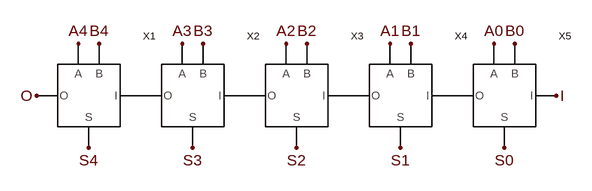
[diagram p0: schematic FULLADDER5.asc]
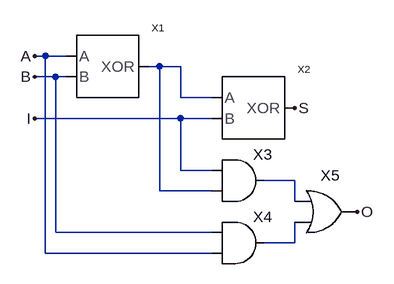
[diagram p1: sub-circuit fulladder.asc]
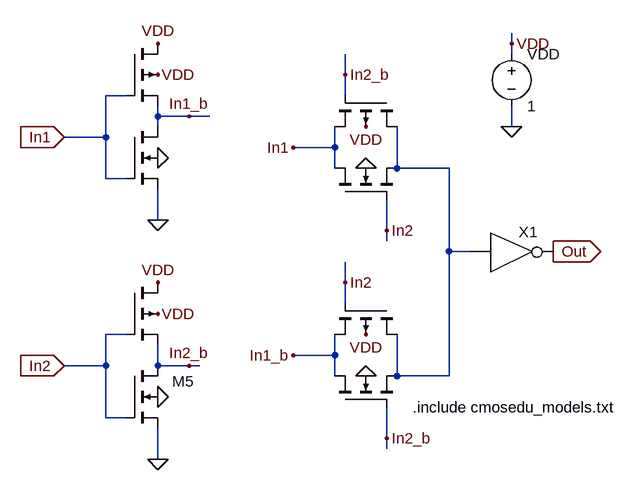
[diagram p2: sub-circuit xor.asc]
FULLADDER5.asc, the LTspice schematic file:
Version 4
SHEET 1 880 680
FLAG 0 192 O
FLAG 704 112 A0
FLAG 544 112 A1
FLAG 384 112 A2
FLAG 224 112 A3
FLAG 64 112 A4
FLAG 720 272 S0
FLAG 560 272 S1
FLAG 400 272 S2
FLAG 240 272 S3
FLAG 80 272 S4
FLAG 736 112 B0
FLAG 576 112 B1
FLAG 416 112 B2
FLAG 256 112 B3
FLAG 96 112 B4
FLAG 800 192 I
SYMBOL FULLADDER 80 192 R0
SYMATTR InstName X1
SYMBOL FULLADDER 240 192 R0
SYMATTR InstName X2
SYMBOL FULLADDER 400 192 R0
SYMATTR InstName X3
SYMBOL FULLADDER 560 192 R0
SYMATTR InstName X4
SYMBOL FULLADDER 720 192 R0
SYMATTR InstName X5

fulladder.asc, the sub-circuit schematic file:
Version 4
SHEET 1 880 680
WIRE 64 128 48 128
WIRE 96 128 64 128
WIRE 240 144 224 144
WIRE 272 144 240 144
WIRE 80 160 48 160
WIRE 96 160 80 160
WIRE 272 192 272 144
WIRE 320 192 272 192
WIRE 272 224 48 224
WIRE 320 224 272 224
WIRE 272 304 272 224
WIRE 320 304 272 304
WIRE 448 320 400 320
WIRE 240 336 240 144
WIRE 320 336 240 336
WIRE 448 352 448 320
WIRE 80 400 80 160
WIRE 320 400 80 400
WIRE 448 416 448 384
WIRE 448 416 400 416
WIRE 64 432 64 128
WIRE 320 432 64 432
FLAG 48 128 A
FLAG 48 160 B
FLAG 48 224 I
FLAG 448 208 S
FLAG 544 368 O
SYMBOL AND2 368 256 R0
SYMATTR InstName X3
SYMBOL AND2 368 352 R0
SYMATTR InstName X4
SYMBOL OR2 496 304 R0
SYMATTR InstName X5
SYMBOL XOR 160 144 R0
SYMATTR InstName X1
SYMBOL XOR 384 208 R0
SYMATTR InstName X2

xor.asc, the sub-circuit schematic file:
Version 4
SHEET 1 1820 680
WIRE 1152 -832 1152 -848
WIRE 1152 -816 1152 -832
WIRE 896 -784 896 -816
WIRE 560 -752 528 -752
WIRE 896 -752 896 -784
WIRE 608 -720 608 -736
WIRE 656 -720 608 -720
WIRE 688 -720 656 -720
WIRE 608 -704 608 -720
WIRE 1152 -704 1152 -736
WIRE 528 -688 528 -752
WIRE 528 -688 464 -688
WIRE 880 -672 880 -704
WIRE 880 -672 816 -672
WIRE 880 -640 880 -672
WIRE 976 -640 976 -704
WIRE 1056 -640 976 -640
WIRE 528 -624 528 -688
WIRE 560 -624 528 -624
WIRE 608 -560 608 -608
WIRE 960 -544 960 -592
WIRE 960 -528 960 -544
WIRE 1056 -512 1056 -640
WIRE 1088 -512 1056 -512
WIRE 896 -464 896 -496
WIRE 896 -432 896 -464
WIRE 560 -384 528 -384
WIRE 880 -352 880 -384
WIRE 880 -352 816 -352
WIRE 528 -336 528 -384
WIRE 528 -336 464 -336
WIRE 608 -336 608 -368
WIRE 656 -336 608 -336
WIRE 672 -336 656 -336
WIRE 880 -320 880 -352
WIRE 976 -320 976 -384
WIRE 1056 -320 1056 -512
WIRE 1056 -320 976 -320
WIRE 528 -256 528 -336
WIRE 560 -256 528 -256
WIRE 960 -224 960 -272
WIRE 960 -208 960 -224
WIRE 608 -192 608 -240
FLAG 608 -656 0
FLAG 1152 -704 0
FLAG 1152 -832 VDD
FLAG 608 -784 VDD
FLAG 608 -560 0
FLAG 608 -832 VDD
FLAG 608 -288 0
FLAG 608 -416 VDD
FLAG 608 -192 0
FLAG 608 -464 VDD
FLAG 928 -320 0
FLAG 928 -384 VDD
FLAG 928 -640 0
FLAG 928 -704 VDD
FLAG 1216 -512 Out
IOPIN 1216 -512 Out
FLAG 464 -688 In1
IOPIN 464 -688 In
FLAG 464 -336 In2
IOPIN 464 -336 In
FLAG 656 -720 In1_b
FLAG 656 -336 In2_b
FLAG 896 -784 In2_b
FLAG 896 -464 In2
FLAG 960 -544 In2
FLAG 960 -224 In2_b
FLAG 816 -352 In1_b
FLAG 816 -672 In1
SYMBOL nmos4 560 -704 R0
WINDOW 0 104 24 Invisible 2
WINDOW 3 179 41 Invisible 2
SYMATTR InstName M1
SYMATTR Value N_50n
SYMATTR Value2 l=50n w=500n
SYMBOL voltage 1152 -832 R0
WINDOW 123 24 126 Left 2
WINDOW 39 24 111 Left 2
SYMATTR InstName VDD
SYMATTR Value 1
SYMBOL pmos4 560 -832 R0
WINDOW 0 88 9 Invisible 2
WINDOW 3 168 20 Invisible 2
SYMATTR InstName M2
SYMATTR Value P_50n
SYMATTR Value2 l=50n w=1u
SYMBOL nmos4 560 -336 R0
WINDOW 0 104 24 Right 2
WINDOW 3 179 41 Invisible 2
SYMATTR InstName M5
SYMATTR Value N_50n
SYMATTR Value2 l=50n w=500n
SYMBOL pmos4 560 -464 R0
WINDOW 0 88 9 Invisible 2
WINDOW 3 168 20 Invisible 2
SYMATTR InstName M6
SYMATTR Value P_50n
SYMATTR Value2 l=50n w=1u
SYMBOL nmos4 880 -272 R270
WINDOW 0 86 42 Invisible 2
WINDOW 3 82 140 Invisible 2
SYMATTR InstName M7
SYMATTR Value N_50n
SYMATTR Value2 l=50n w=500n
SYMBOL pmos4 976 -432 R90
WINDOW 0 71 26 Invisible 2
WINDOW 3 75 133 Invisible 2
SYMATTR InstName M3
SYMATTR Value P_50n
SYMATTR Value2 l=50n w=1u
SYMBOL nmos4 880 -592 R270
WINDOW 0 86 42 Invisible 2
WINDOW 3 82 140 Invisible 2
SYMATTR InstName M13
SYMATTR Value N_50n
SYMATTR Value2 l=50n w=500n
SYMBOL pmos4 976 -752 R90
WINDOW 0 71 26 Invisible 2
WINDOW 3 75 133 Invisible 2
SYMATTR InstName M14
SYMATTR Value P_50n
SYMATTR Value2 l=50n w=1u
SYMBOL NOT 1120 -544 R0
SYMATTR InstName X1
TEXT 1000 -272 Left 2 !.include cmosedu_models.txt

The netlist it stands for:
* FULLADDER5.asc
XX1 A4 B4 O P001 S4 fulladder
XX2 A3 B3 P001 P002 S3 fulladder
XX3 A2 B2 P002 P003 S2 fulladder
XX4 A1 B1 P003 P004 S1 fulladder
XX5 A0 B0 P004 I S0 fulladder

* block symbol definitions
.subckt fulladder A B O I S
XX3 I N001 N002 AND2  ; pins In1 In2 Out
XX4 B A N003 AND2  ; pins In1 In2 Out
XX5 N002 N003 O OR2  ; pins In1 In2 Out
XX1 N001 A B xor
XX2 S N001 I xor
.ends fulladder

.subckt xor Out In1 In2
M1 In1_b In1 0 0 N_50n l=50n w=500n
VDD VDD 0 1
M2 VDD In1 In1_b VDD P_50n l=50n w=1u
M5 In2_b In2 0 0 N_50n l=50n w=500n
M6 VDD In2 In2_b VDD P_50n l=50n w=1u
M7 In1_b In2_b N001 0 N_50n l=50n w=500n
M3 N001 In2 In1_b VDD P_50n l=50n w=1u
M13 In1 In2 N001 0 N_50n l=50n w=500n
M14 N001 In2_b In1 VDD P_50n l=50n w=1u
XX1 N001 Out NOT  ; pins In Out
.include cmosedu_models.txt
.ends xor

.model NMOS NMOS
.model PMOS PMOS
.lib standard.mos
.backanno
.end